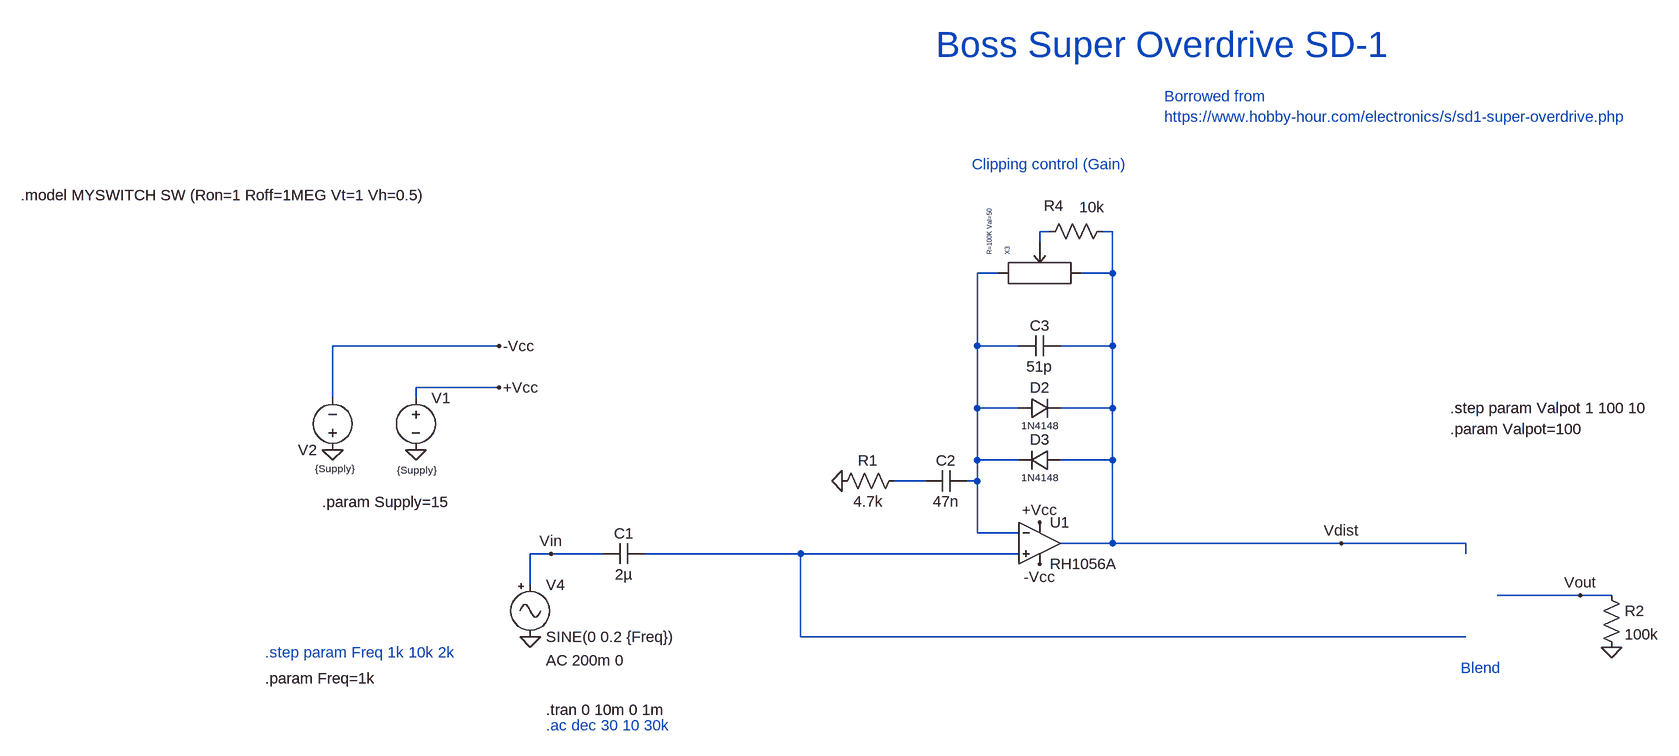
[diagram p0: schematic TubeScreamer.asc]
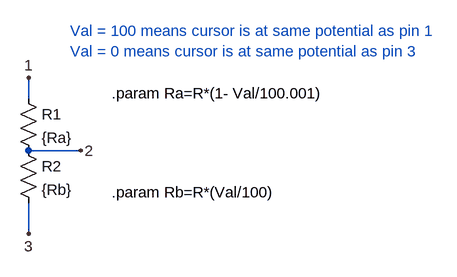
[diagram p1: sub-circuit potentiometer.asc]
TubeScreamer.asc, the LTspice schematic file:
Version 4
SHEET 1 4652 680
WIRE 544 -320 528 -320
WIRE 640 -320 624 -320
WIRE 528 -304 528 -320
WIRE 464 -256 432 -256
WIRE 640 -256 640 -320
WIRE 640 -256 592 -256
WIRE -304 -144 -560 -144
WIRE 432 -144 432 -256
WIRE 496 -144 432 -144
WIRE 640 -144 640 -256
WIRE 640 -144 560 -144
WIRE -304 -80 -432 -80
WIRE -560 -64 -560 -144
WIRE -432 -64 -432 -80
WIRE 432 -48 432 -144
WIRE 496 -48 432 -48
WIRE 640 -48 640 -144
WIRE 640 -48 560 -48
WIRE 432 32 432 -48
WIRE 496 32 432 32
WIRE 640 32 640 -48
WIRE 640 32 560 32
WIRE 352 64 304 64
WIRE 432 64 432 32
WIRE 432 64 416 64
WIRE 432 144 432 64
WIRE 496 144 432 144
WIRE 640 160 640 32
WIRE 640 160 560 160
WIRE 992 160 640 160
WIRE 1184 160 992 160
WIRE -224 176 -256 176
WIRE -144 176 -224 176
WIRE 160 176 -80 176
WIRE 496 176 160 176
WIRE 1184 176 1184 160
WIRE -256 224 -256 176
WIRE 1360 240 1232 240
WIRE 1408 240 1360 240
WIRE 160 304 160 176
WIRE 1184 304 160 304
FLAG -560 16 0
FLAG -432 16 0
FLAG -304 -80 +Vcc
FLAG -304 -144 -Vcc
FLAG 528 128 +Vcc
FLAG 528 192 -Vcc
FLAG -256 304 0
FLAG 224 64 0
FLAG 1408 320 0
FLAG -224 176 Vin
FLAG 992 160 Vdist
FLAG 1360 240 Vout
SYMBOL cap -80 160 R90
WINDOW 0 0 32 VBottom 2
WINDOW 3 32 32 VTop 2
SYMATTR InstName C1
SYMATTR Value 2µ
SYMBOL voltage -432 -80 R0
WINDOW 123 0 0 Left 0
WINDOW 39 0 0 Left 0
WINDOW 3 -29 127 Left 1
SYMATTR Value {Supply}
SYMATTR InstName V1
SYMBOL voltage -560 32 R180
WINDOW 123 0 0 Left 0
WINDOW 39 0 0 Left 0
WINDOW 3 -33 -13 Left 1
SYMATTR Value {Supply}
SYMATTR InstName V2
SYMBOL diode 496 -32 R270
WINDOW 0 32 32 VTop 2
WINDOW 3 0 32 VBottom 1
SYMATTR InstName D2
SYMATTR Value 1N4148
SYMBOL Misc\\signal -256 208 R0
WINDOW 123 24 132 Left 2
WINDOW 39 0 0 Left 0
SYMATTR Value2 AC 200m 0
SYMATTR InstName V4
SYMATTR Value SINE(0 0.2 {Freq})
SYMBOL OpAmps\\RH1056A 528 96 R0
SYMATTR InstName U1
SYMBOL diode 560 16 R90
WINDOW 0 0 32 VBottom 2
WINDOW 3 32 32 VTop 1
SYMATTR InstName D3
SYMATTR Value 1N4148
SYMBOL res 320 48 R90
WINDOW 0 0 56 VBottom 2
WINDOW 3 32 56 VTop 2
SYMATTR InstName R1
SYMATTR Value 4.7k
SYMBOL res 1392 224 R0
SYMATTR InstName R2
SYMATTR Value 100k
SYMBOL cap 416 48 R90
WINDOW 0 0 32 VBottom 2
WINDOW 3 32 32 VTop 2
SYMATTR InstName C2
SYMATTR Value 47n
SYMBOL cap 560 -160 R90
WINDOW 0 0 32 VBottom 2
WINDOW 3 32 32 VTop 2
SYMATTR InstName C3
SYMATTR Value 51p
SYMBOL res 640 -336 R90
WINDOW 0 -8 90 VBottom 2
WINDOW 3 -37 31 VTop 2
SYMATTR InstName R4
SYMATTR Value 10k
SYMBOL Potentiometer 528 -256 R270
WINDOW 39 28 -77 Left 0
SYMATTR InstName X3
SYMATTR SpiceLine R=100K Val=50
TEXT -232 416 Left 2 !.tran 0 10m 0 1m
TEXT -1040 -376 Left 2 !.model MYSWITCH SW (Ron=1 Roff=1MEG Vt=1 Vh=0.5)
TEXT -576 96 Left 2 !.param Supply=15
TEXT 1160 -48 Left 2 !.step param Valpot 1 100 10
TEXT 1160 -16 Left 2 !.param Valpot=100
TEXT 1176 352 Left 2 ;Blend
TEXT 424 -424 Left 2 ;Clipping control (Gain)
TEXT -664 328 Left 2 ;.step param Freq 1k 10k 2k
TEXT -664 368 Left 2 !.param Freq=1k
TEXT 720 -528 Left 2 ;Borrowed from \nhttps://www.hobby-hour.com/electronics/s/sd1-super-overdrive.php
TEXT 368 -608 Left 5 ;Boss Super Overdrive SD-1
TEXT -232 440 Left 2 ;.ac dec 30 10 30k

potentiometer.asc, the sub-circuit schematic file:
Version 4
SHEET 1 908 680
WIRE 192 96 192 64
WIRE 272 176 192 176
WIRE 192 304 192 256
FLAG 192 64 1
FLAG 272 176 2
FLAG 192 304 3
SYMBOL res 176 80 R0
SYMATTR InstName R1
SYMATTR Value {Ra}
SYMBOL res 176 160 R0
SYMATTR InstName R2
SYMATTR Value {Rb}
TEXT 320 88 Left 2 !.param Ra=R*(1- Val/100.001)
TEXT 320 240 Left 2 !.param Rb=R*(Val/100)
TEXT 256 -8 Left 2 ;Val = 100 means cursor is at same potential as pin 1\nVal = 0 means cursor is at same potential as pin 3

The netlist it stands for:
* TubeScreamer.asc
C1 N004 Vin 2µ
V1 +Vcc 0 {Supply}
V2 0 -Vcc {Supply}
D2 N002 Vdist 1N4148
V4 Vin 0 SINE(0 0.2 {Freq}) AC 200m 0
XU1 N004 N002 +Vcc -Vcc Vdist RH1056A  ; pins In+ In- V+ V- OUT
D3 Vdist N002 1N4148
R1 N003 0 4.7k
R2 Vout 0 100k
C2 N002 N003 47n
C3 Vdist N002 51p
R4 Vdist N001 10k
XX3 N002 N001 Vdist potentiometer params: R=100K Val=50

* block symbol definitions
.subckt potentiometer 1 2 3
R1 1 2 {Ra}
R2 2 3 {Rb}
.param Ra=R*(1- Val/100.001)
.param Rb=R*(Val/100)
* Val = 100 means cursor is at same potential as pin 1
* Val = 0 means cursor is at same potential as pin 3
.ends potentiometer

.model D D
.lib standard.dio
.tran 0 10m 0 1m
.model MYSWITCH SW (Ron=1 Roff=1MEG Vt=1 Vh=0.5)
.param Supply=15
.step param Valpot 1 100 10
.param Valpot=100
* Blend
* Clipping control (Gain)
* .step param Freq 1k 10k 2k
.param Freq=1k
* Borrowed from
* https://www.hobby-hour.com/electronics/s/sd1-super-overdrive.php
* Boss Super Overdrive SD-1
* .ac dec 30 10 30k
.backanno
.end